# Altium project buck converter.PrjPcb
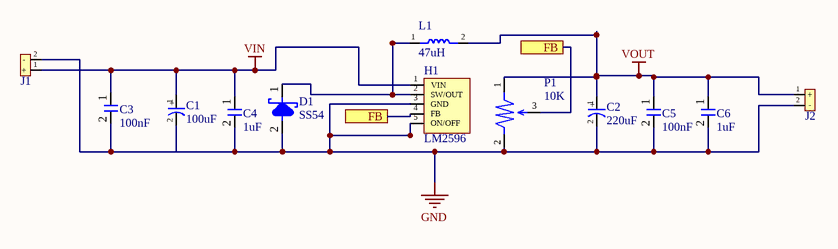
[diagram p0: schmetic buck converter.SchDoc]
1 sheet, 12 parts. Net scope: flat (ports and power ports of the same name join across sheets).
Board file: BUCK CONVERTER PCB.PcbDoc

## Sheet schmetic buck converter.SchDoc
size A4; SheetNumber: 1; SheetTotal: 1

### Parts
C1  100uF  [electrolytic capacitor]
C2  220uF  [elecrolitic]
C3  100nF  [CAPACITOR0805]
C4  1uF  [CAPACITOR0805]
C5  100nF  [CAPACITOR0805]
C6  1uF  [CAPACITOR0805]
D1  SS54  [schkooty diode]
H1  LM2596  [TO263-5L]
J1  1X2 HEADER  [connector block2pin]  (value not drawn)
J2  1X2 HEADER  [connector block2pin]  (value not drawn)
L1  47uH  [inductor]
P1  10K  [POTENTIOMETER]

### Ports
FB (see schmetic buck converter[2B]), FB (see schmetic buck converter[3B])

### Nets
GND: C1.2 C2.2 C3.2 C4.2 C5.2 C6.2 D1.2 H1.3(GND) H1.5(ON/OFF) J1.2(-) J2.2(-) P1.2
VIN: C1.1(+) C3.1 C4.1 H1.1(VIN) J1.1(+)
VOUT: C2.1(+) C5.1 C6.1 J2.1(+) L1.2(L?) P1.1
NetD1_1: D1.1 H1.2(SW/OUT) L1.1(L?)
NetH1_4: H1.4(FB) P1.3 ; port FB

### Library data of the parts
C1 C2 = CAPACITOR: POLERIZED
C3-C6 = CAPACITOR..: UNPOLERIZED
D1 = Schottky Diode
H1 = LM2596: TO263-5L
J1 J2 = terminalblock 2 pin: Manufacturer: Molex; Manufacturer Lifecycle Status: ACTIVE; Approvals: CSA, UL; Contact Resistance: 10mΩ; Current Rating: 4A; Dielectric Material: Polyamide; Gender: Male; Insulation Resistance: 1GΩ; Number of Circuits: 2; Pitch: 2.54mm; Plating: Tin; Plating Thickness: 2.54µm; Ratings: CSA; Voltage Rating: 500V; Voltage Rating (AC): 250V; Supplier: DigiKey; Supplier Part Number: WM4111-ND; Manufacturer Part Number: 22-27-2021; RoHS: Compliant; Category: Headers and Wire Housings; Stock: 142263; Pricing: 1=0.21, 10=0.182, 100=0.1546, 500=0.13798, 2850=0.12202, 5700=0.11619, 11400=0.11065 (USD); China RoHS: Compliant; Color: White; Contact Gender: Male; Contact Material: Brass; Contact Plating: Tin; Country of Origin: TH; Depth: 5.8mm; Export Control Classification Number (ECCN) Code: EAR99; Flammability Rating: UL94 V-0; Height: 12.05mm; Housing Color: Natural; Housing Material: Nylon; Harmonized Tariff Schedule (HTS) Code: 8536.69.40.40; Introduction Date: 1994-12-01; Lead Free: Lead Free; Lead Pitch: 2.54mm; Length: 10.16mm; Lifecycle Status: Production; Material: Nylon; Max Current Rating: 4A; Max Operating Temperature: 75°C; Min Operating Temperature: 0°C; Mounting Technology: Through Hole; Number of Contacts: 2; Pins: 2; Number of Positions: 2; Number of Rows: 1; Orientation: Vertical; Radiation Hardening: No; REACH SVHC: Yes; Schedule B: 8536694040, 8536694040|8536694040|8536694040|8536694040|8536694040|8536694040|8536694040|8536694040|8536694040|8536694040|8536694040|8536694040|8536694040|8536694040|8536694040|8536694040|8536694040|8536694040|8536694040|8536694040|8536694040|8536694040|8536694040|85; Terminal Pitch: 2.54mm; Termination: Solder; Voltage Rating (DC): 250V; Working Voltage: 250V; ComponentLink1URL: https://datasheet.octopart.com:443/22-27-2021-Molex-datasheet-81843831.pdf?src-supplier=Upverter; ComponentLink1Description: https://datasheet.octopart.com:443/22-27-2021-Molex-datasheet-81843831.pdf?src-supplier=Upverter; ComponentLink2URL: https://datasheet.octopart.com:443/22-27-2021-Molex-datasheet-10979409.pdf?src-supplier=Molex; ComponentLink2Description: https://datasheet.octopart.com:443/22-27-2021-Molex-datasheet-10979409.pdf?src-supplier=Molex; ComponentLink3URL: https://datasheet.octopart.com:443/02227-2021-Molex-datasheet-13784872.pdf?src-supplier=Molex; ComponentLink3Description: https://datasheet.octopart.com:443/02227-2021-Molex-datasheet-13784872.pdf?src-supplier=Molex; ComponentLink4URL: https://datasheet.octopart.com:443/22-27-2021-Molex-datasheet-5315839.pdf?src-supplier=Future+Electronics; ComponentLink4Description: https://datasheet.octopart.com:443/22-27-2021-Molex-datasheet-5315839.pdf?src-supplier=Future+Electronics; ComponentLink5URL: https://datasheet.octopart.com:443/22272021-Molex-datasheet-137316104.pdf?src-supplier=Future+Electronics; ComponentLink5Description: https://datasheet.octopart.com:443/22272021-Molex-datasheet-137316104.pdf?src-supplier=Future+Electronics; ComponentLink6URL: https://datasheet.octopart.com:443/22-27-2021-Molex-datasheet-193085717.pdf?src-supplier=JRH+Electronics; ComponentLink6Description: https://datasheet.octopart.com:443/22-27-2021-Molex-datasheet-193085717.pdf?src-supplier=JRH+Electronics; ComponentLink7URL: https://datasheet.octopart.com:443/22-27-2021-Molex-datasheet-154747145.pdf?src-supplier=Master+Electronics; ComponentLink7Description: https://datasheet.octopart.com:443/22-27-2021-Molex-datasheet-154747145.pdf?src-supplier=Master+Electronics; ComponentLink8URL: https://datasheet.octopart.com:443/22-27-2021-Molex-datasheet-101581847.pdf?src-supplier=Farnell; ComponentLink8Description: https://datasheet.octopart.com:443/22-27-2021-Molex-datasheet-101581847.pdf?src-supplier=Farnell; ComponentLink9URL: https://datasheet.octopart.com:443/02227-2021-Molex-datasheet-14711101.pdf?src-supplier=Farnell; ComponentLink9Description: https://datasheet.octopart.com:443/02227-2021-Molex-datasheet-14711101.pdf?src-supplier=Farnell; ComponentLink10URL: https://datasheet.octopart.com:443/22-27-2021-Molex-datasheet-506551.pdf?src-supplier=Farnell; ComponentLink10Description: https://datasheet.octopart.com:443/22-27-2021-Molex-datasheet-506551.pdf?src-supplier=Farnell; ComponentLink11URL: https://datasheet.octopart.com:443/22-27-2021-Molex-datasheet-21538535.pdf?src-supplier=Newark; ComponentLink11Description: https://datasheet.octopart.com:443/22-27-2021-Molex-datasheet-21538535.pdf?src-supplier=Newark; ComponentLink12URL: https://datasheet.octopart.com:443/22-27-2021-Molex-datasheet-38329585.pdf?src-supplier=Newark; ComponentLink12Description: https://datasheet.octopart.com:443/22-27-2021-Molex-datasheet-38329585.pdf?src-supplier=Newark; ComponentLink13URL: https://datasheet.octopart.com:443/22-27-2021-Molex-datasheet-33021744.pdf?src-supplier=Newark; ComponentLink13Description: https://datasheet.octopart.com:443/22-27-2021-Molex-datasheet-33021744.pdf?src-supplier=Newark; ComponentLink14URL: https://datasheet.octopart.com:443/22-27-2021-Molex-datasheet-33002331.pdf?src-supplier=Newark; ComponentLink14Description: https://datasheet.octopart.com:443/22-27-2021-Molex-datasheet-33002331.pdf?src-supplier=Newark; ComponentLink15URL: https://datasheet.octopart.com:443/02227-2021-Molex-datasheet-21206939.pdf?src-supplier=Newark; ComponentLink15Description: https://datasheet.octopart.com:443/02227-2021-Molex-datasheet-21206939.pdf?src-supplier=Newark; ComponentLink16URL: https://datasheet.octopart.com:443/22-27-2021-Molex-datasheet-604178.pdf?src-supplier=element14+APAC; ComponentLink16Description: https://datasheet.octopart.com:443/22-27-2021-Molex-datasheet-604178.pdf?src-supplier=element14+APAC; ComponentLink17URL: https://datasheet.octopart.com:443/0022272021-Molex-datasheet-164461543.pdf?src-supplier=Sager+Electronics; ComponentLink17Description: https://datasheet.octopart.com:443/0022272021-Molex-datasheet-164461543.pdf?src-supplier=Sager+Electronics; ComponentLink18URL: https://datasheet.octopart.com:443/22-27-2021-Molex-datasheet-158567618.pdf?src-supplier=RS+(Formerly+Allied+Electronics); ComponentLink18Description: https://datasheet.octopart.com:443/22-27-2021-Molex-datasheet-158567618.pdf?src-supplier=RS+(Formerly+Allied+Electronics); ComponentLink19URL: https://datasheet.octopart.com:443/22-27-2021-Molex-datasheet-140181058.pdf?src-supplier=RS+(Formerly+Allied+Electronics); ComponentLink19Description: https://datasheet.octopart.com:443/22-27-2021-Molex-datasheet-140181058.pdf?src-supplier=RS+(Formerly+Allied+Electronics); ComponentLink20URL: https://datasheet.octopart.com:443/22-27-2021-Molex-datasheet-120145351.pdf?src-supplier=RS+(Formerly+Allied+Electronics); ComponentLink20Description: https://datasheet.octopart.com:443/22-27-2021-Molex-datasheet-120145351.pdf?src-supplier=RS+(Formerly+Allied+Electronics); ComponentLink21URL: https://datasheet.octopart.com:443/22-27-2021-Molex-datasheet-9995492.pdf?src-supplier=RS+(Formerly+Allied+Electronics); ComponentLink21Description: https://datasheet.octopart.com:443/22-27-2021-Molex-datasheet-9995492.pdf?src-supplier=RS+(Formerly+Allied+Electronics); ComponentLink22URL: https://datasheet.octopart.com:443/22-27-2021-Molex-datasheet-155977274.pdf?src-supplier=SOS+electronic; ComponentLink22Description: https://datasheet.octopart.com:443/22-27-2021-Molex-datasheet-155977274.pdf?src-supplier=SOS+electronic; ComponentLink23URL: https://datasheet.octopart.com:443/22-27-2021-Molex-datasheet-62103479.pdf?src-supplier=Electro+Sonic; ComponentLink23Description: https://datasheet.octopart.com:443/22-27-2021-Molex-datasheet-62103479.pdf?src-supplier=Electro+Sonic; ComponentLink24URL: https://datasheet.octopart.com:443/22-27-2021-Molex-datasheet-37168867.pdf?src-supplier=Electro+Sonic; ComponentLink24Description: https://datasheet.octopart.com:443/22-27-2021-Molex-datasheet-37168867.pdf?src-supplier=Electro+Sonic; ComponentLink25URL: https://datasheet.octopart.com:443/22-27-2021-Molex-datasheet-151821780.pdf?src-supplier=Toby+Electronics; ComponentLink25Description: https://datasheet.octopart.com:443/22-27-2021-Molex-datasheet-151821780.pdf?src-supplier=Toby+Electronics; ComponentLink26URL: https://datasheet.octopart.com:443/22-27-2021-Molex-datasheet-124775.pdf?src-supplier=DigiKey; ComponentLink26Description: https://datasheet.octopart.com:443/22-27-2021-Molex-datasheet-124775.pdf?src-supplier=DigiKey; ComponentLink27URL: https://datasheet.octopart.com:443/22-27-2021-Molex-datasheet-7627818.pdf?src-supplier=Jameco; ComponentLink27Description: https://datasheet.octopart.com:443/22-27-2021-Molex-datasheet-7627818.pdf?src-supplier=Jameco; ComponentLink28URL: https://datasheet.octopart.com:443/22-27-2021-Molex-datasheet-17586671.pdf?src-supplier=TME; ComponentLink28Description: https://datasheet.octopart.com:443/22-27-2021-Molex-datasheet-17586671.pdf?src-supplier=TME; ComponentLink29URL: http://sigma.octopart.com:80/16297726/rohs_statement/Molex-02227-2021.pdf?src-supplier=Compliance+Statements; ComponentLink29Description: http://sigma.octopart.com:80/16297726/rohs_statement/Molex-02227-2021.pdf?src-supplier=Compliance+Statements; ComponentLink30URL: http://sigma.octopart.com:80/reach_statement/Molex-company-74.pdf?src-supplier=Compliance+Statements; ComponentLink30Description: http://sigma.octopart.com:80/reach_statement/Molex-company-74.pdf?src-supplier=Compliance+Statements; ComponentLink31URL: http://sigma.octopart.com:80/rohs_statement/Molex-company-73.pdf?src-supplier=Compliance+Statements; ComponentLink31Description: http://sigma.octopart.com:80/rohs_statement/Molex-company-73.pdf?src-supplier=Compliance+Statements; ComponentLink32URL: http://sigma.octopart.com:80/conflict_mineral_statement/Molex-company-72.pdf?src-supplier=Compliance+Statements; ComponentLink32Description: http://sigma.octopart.com:80/conflict_mineral_statement/Molex-company-72.pdf?src-supplier=Compliance+Statements
L1 = INDUCTOR
P1 = POTENTIOMETER